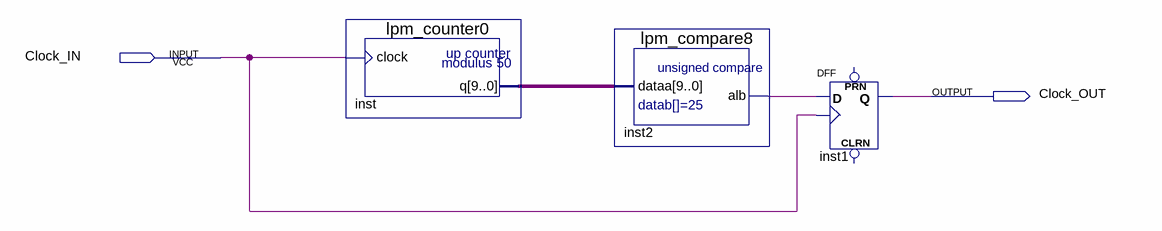
[diagram p0: schematic sheet]
// Quartus schematic ClockDividerTest.bdf as structural Verilog: 3 symbols, 2 pins
module ClockDividerTest (
  input  Clock_IN,
  output Clock_OUT
);

  wire inst2_alb;
  wire [9:0] inst_q;

  lpm_counter0 inst (.clock(Clock_IN), .q(inst_q));
  lpm_compare8 inst2 (.dataa(inst_q), .alb(inst2_alb));
  DFF inst1 (.CLK(Clock_IN), .D(inst2_alb), .Q(Clock_OUT));  // open: CLRN, PRN
endmodule
